# EAGLE design Nixie_Controller (EAGLE 9.0.1)
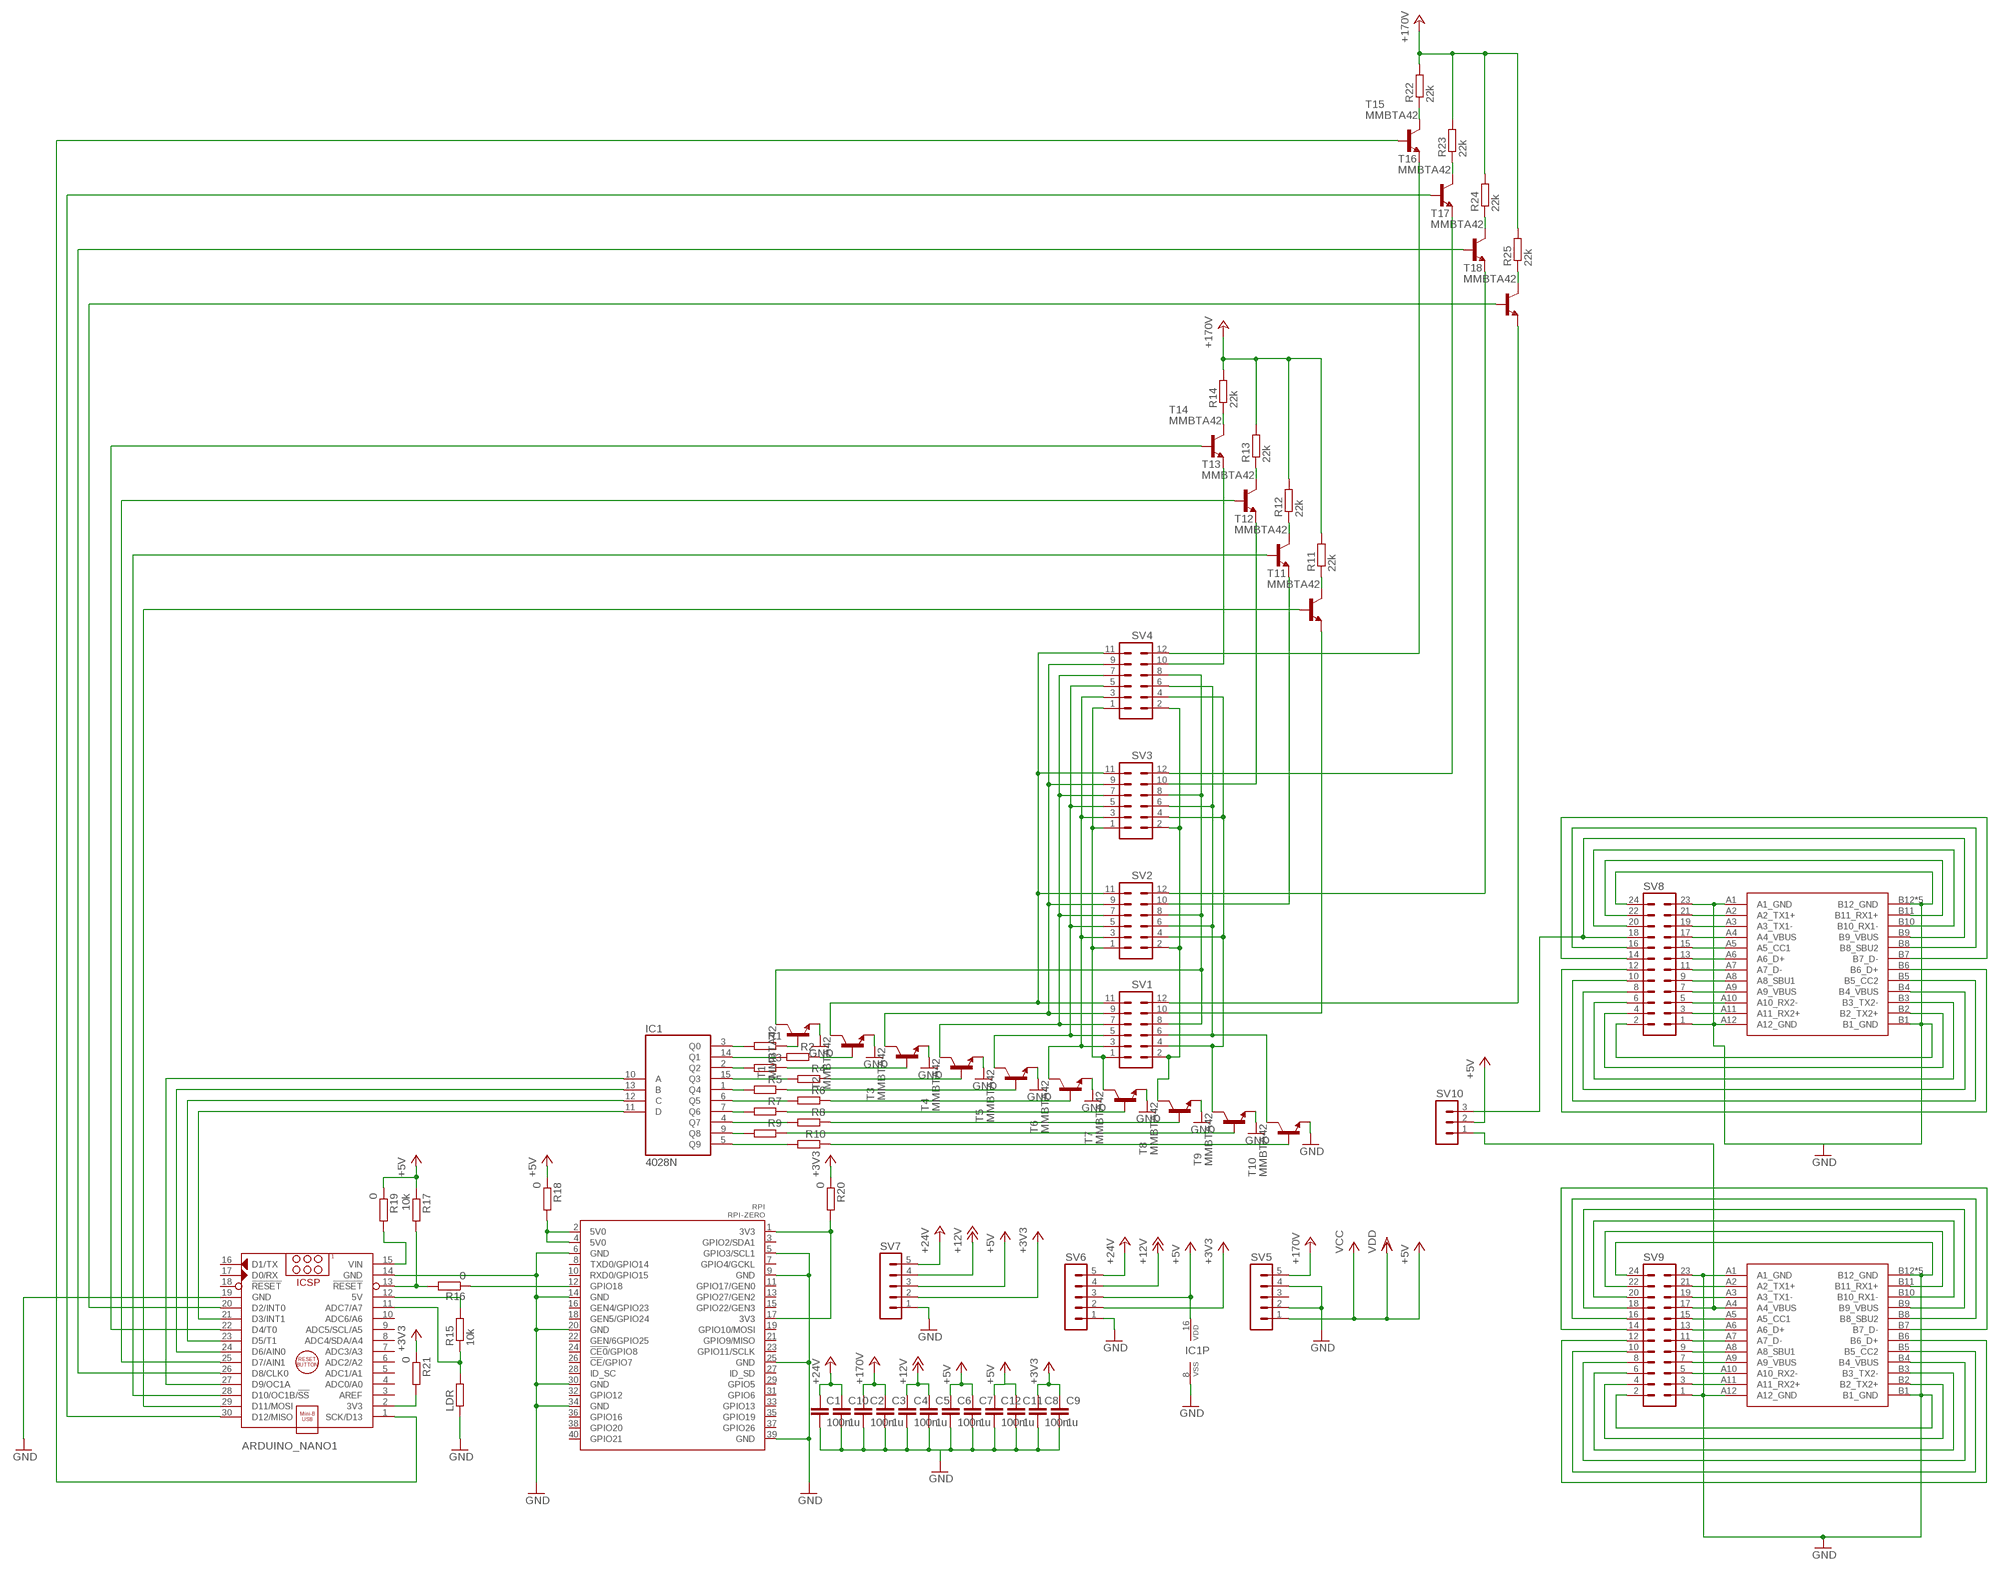
[diagram p0: schematic, sheet 1]

## Parts
ARDUINO_NANO1  ARDUINO_NANO  [ARDUINO_NANO]
C1  100n  C-EUC0805  [C0805]
C2  100n  C-EUC0805  [C0805]
C3  1u  C-EUC0805  [C0805]
C4  100n  C-EUC0805  [C0805]
C5  1u  C-EUC0805  [C0805]
C6  100n  C-EUC0805  [C0805]
C7  1u  C-EUC0805  [C0805]
C8  100n  C-EUC0805  [C0805]
C9  1u  C-EUC0805  [C0805]
C10  1u  C-EUC0805  [C0805]
C11  1u  C-EUC0805  [C0805]
C12  100n  C-EUC0805  [C0805]
IC1  4028N  [DIL16]
LDR  R-EU_0204/7  [0204/7]
R1  R-EU_R0603  [R0603]
R2  R-EU_R0603  [R0603]
R3  R-EU_R0603  [R0603]
R4  R-EU_R0603  [R0603]
R5  R-EU_R0603  [R0603]
R6  R-EU_R0603  [R0603]
R7  R-EU_R0603  [R0603]
R8  R-EU_R0603  [R0603]
R9  R-EU_R0603  [R0603]
R10  R-EU_R0603  [R0603]
R11  22k  R-EU_R0603  [R0603]
R12  22k  R-EU_R0603  [R0603]
R13  22k  R-EU_R0603  [R0603]
R14  22k  R-EU_R0603  [R0603]
R15  10k  R-EU_R0603  [R0603]
R16  0  R-EU_R0603  [R0603]
R17  10k  R-EU_R0603  [R0603]
R18  0  R-EU_R0603  [R0603]
R19  0  R-EU_R0603  [R0603]
R20  0  R-EU_R0603  [R0603]
R21  0  R-EU_R0603  [R0603]
R22  22k  R-EU_R0603  [R0603]
R23  22k  R-EU_R0603  [R0603]
R24  22k  R-EU_R0603  [R0603]
R25  22k  R-EU_R0603  [R0603]
RPI  RPI-ZERO  [RASP_PI_ZERO_BOARD_FULL]
SV1  MA06-2  [MA06-2]
SV2  MA06-2  [MA06-2]
SV3  MA06-2  [MA06-2]
SV4  MA06-2  [MA06-2]
SV5  MA05-1  [MA05-1]
SV6  MA05-1  [MA05-1]
SV7  MA05-1  [MA05-1]
SV8  MA12-2  [MA12-2]
SV9  MA12-2  [MA12-2]
SV10  MA03-1  [MA03-1]
T1  MMBTA42  BC850  [SOT23]
T2  MMBTA42  BC850  [SOT23]
T3  MMBTA42  BC850  [SOT23]
T4  MMBTA42  BC850  [SOT23]
T5  MMBTA42  BC850  [SOT23]
T6  MMBTA42  BC850  [SOT23]
T7  MMBTA42  BC850  [SOT23]
T8  MMBTA42  BC850  [SOT23]
T9  MMBTA42  BC850  [SOT23]
T10  MMBTA42  BC850  [SOT23]
T11  MMBTA42  BC850  [SOT23]
T12  MMBTA42  BC850  [SOT23]
T13  MMBTA42  BC850  [SOT23]
T14  MMBTA42  BC850  [SOT23]
T15  MMBTA42  BC850  [SOT23]
T16  MMBTA42  BC850  [SOT23]
T17  MMBTA42  BC850  [SOT23]
T18  MMBTA42  BC850  [SOT23]
USBC1  USB-TYPE-C  [USB-TYPE-C]
USBC2  USB-TYPE-C  [USB-TYPE-C]

## Nets
3V3@2: R20.2 RPI.1(3V3) RPI.17(3V3)
+3V3: C8.1 C9.1 R20.1 R21.1 SV6.2 SV7.2
+5V: R18.2 RPI.2(5V0) RPI.4(5V0)
+12V: C4.1 C5.1 SV6.4 SV7.4
+24V: C1.1 C10.1 SV6.5 SV7.5
+170V: C2.1 C3.1 R11.2 R12.2 R13.2 R14.2 R22.2 R23.2 R24.2 R25.2 SV5.5
GND: ARDUINO_NANO1.14(GND) ARDUINO_NANO1.19(GND) C1.2 C2.2 C3.2 C4.2 C5.2 C6.2 C7.2 C8.2 C9.2 C10.2 C11.2 C12.2 IC1.8(VSS) LDR.1 RPI.5(GPIO3/SCL1) RPI.6(GND) RPI.9(GND) RPI.14(GND) RPI.20(GND) RPI.25(GND) RPI.30(GND) RPI.34(GND) RPI.39(GND) SV5.2 SV5.4 SV6.1 SV7.1 SV8.1 SV8.2 SV8.23 SV8.24 SV9.1 SV9.2 SV9.23 SV9.24 T1.2(E) T2.2(E) T3.2(E) T4.2(E) T5.2(E) T6.2(E) T7.2(E) T8.2(E) T9.2(E) T10.2(E) USBC1.A1(A1_GND) USBC1.A12(A12_GND) USBC1.B1(B1_GND) USBC1.B12(B12_GND) USBC1.C1(B12_GND) USBC1.C2(B12_GND) USBC1.C3(B12_GND) USBC1.C4(B12_GND) USBC2.A1(A1_GND) USBC2.A12(A12_GND) USBC2.B1(B1_GND) USBC2.B12(B12_GND) USBC2.C1(B12_GND) USBC2.C2(B12_GND) USBC2.C3(B12_GND) USBC2.C4(B12_GND)
N$1: IC1.3(Q0) R1.2
N$2: IC1.14(Q1) R2.2
N$3: IC1.2(Q2) R3.2
N$4: IC1.15(Q3) R4.2
N$5: IC1.1(Q4) R5.2
N$6: IC1.6(Q5) R6.2
N$7: IC1.7(Q6) R7.2
N$8: IC1.4(Q7) R8.2
N$9: IC1.9(Q8) R9.2
N$10: IC1.5(Q9) R10.2
N$11: R1.1 T1.1(B)
N$12: R2.1 T2.1(B)
N$13: R3.1 T3.1(B)
N$14: R4.1 T4.1(B)
N$15: R6.1 T6.1(B)
N$16: R5.1 T5.1(B)
N$17: R7.1 T7.1(B)
N$18: R8.1 T8.1(B)
N$19: R10.1 T10.1(B)
N$20: R9.1 T9.1(B)
N$21: SV1.11 SV2.11 SV3.11 SV4.11 T2.3(C)
N$22: SV1.9 SV2.9 SV3.9 SV4.9 T3.3(C)
N$23: SV1.7 SV2.7 SV3.7 SV4.7 T4.3(C)
N$24: SV1.5 SV2.5 SV3.5 SV4.5 T5.3(C)
N$25: SV1.3 SV2.3 SV3.3 SV4.3 T6.3(C)
N$26: SV1.1 SV2.1 SV3.1 SV4.1 T7.3(C)
N$27: SV1.2 SV2.2 SV3.2 SV4.2 T8.3(C)
N$28: SV1.4 SV2.4 SV3.4 SV4.4 T9.3(C)
N$29: SV1.6 SV2.6 SV3.6 SV4.6 T10.3(C)
N$30: SV1.8 SV2.8 SV3.8 SV4.8 T1.3(C)
N$31: R14.1 T14.3(C)
N$32: R11.1 T11.3(C)
N$33: R12.1 T12.3(C)
N$34: R13.1 T13.3(C)
N$35: SV4.10 T14.2(E)
N$36: SV3.10 T13.2(E)
N$37: SV2.10 T12.2(E)
N$38: SV1.10 T11.2(E)
N$39: ARDUINO_NANO1.2(3V3) R21.2
N$40: ARDUINO_NANO1.28(D10/OC1B/!SS) T12.1(B)
N$41: SV8.21 USBC2.A2(A2_TX1+)
N$42: SV8.19 USBC2.A3(A3_TX1-)
N$43: ARDUINO_NANO1.13(!RESET) R16.2 R17.2
N$44: ARDUINO_NANO1.12(5V) R15.2
N$45: ARDUINO_NANO1.11(ADC7/A7) LDR.2 R15.1
N$46: ARDUINO_NANO1.29(D11/MOSI) T11.1(B)
N$47: SV8.17 USBC2.A4(A4_VBUS)
N$48: ARDUINO_NANO1.25(D7/AIN1) T13.1(B)
N$49: ARDUINO_NANO1.22(D4/T0) T14.1(B)
N$50: SV8.15 USBC2.A5(A5_CC1)
N$51: SV8.13 USBC2.A6(A6_D+)
N$52: SV8.11 USBC2.A7(A7_D-)
N$53: SV8.9 USBC2.A8(A8_SBU1)
N$54: SV8.7 USBC2.A9(A9_VBUS)
N$55: SV8.5 USBC2.A10(A10_RX2-)
N$56: SV8.3 USBC2.A11(A11_RX2+)
N$57: R22.1 T15.3(C)
N$58: R25.1 T18.3(C)
N$59: SV9.21 USBC1.A2(A2_TX1+)
N$60: SV9.19 USBC1.A3(A3_TX1-)
N$61: SV9.17 SV10.1 USBC1.A4(A4_VBUS)
N$62: SV9.15 USBC1.A5(A5_CC1)
N$63: SV9.13 USBC1.A6(A6_D+)
N$64: SV9.11 USBC1.A7(A7_D-)
N$65: SV9.9 USBC1.A8(A8_SBU1)
N$66: SV9.7 USBC1.A9(A9_VBUS)
N$67: SV9.5 USBC1.A10(A10_RX2-)
N$68: SV9.3 USBC1.A11(A11_RX2+)
N$69: R24.1 T17.3(C)
N$70: R23.1 T16.3(C)
N$71: SV9.4 USBC1.B2(B2_TX2+)
N$72: SV9.6 USBC1.B3(B3_TX2-)
N$73: SV9.8 USBC1.B4(B4_VBUS)
N$74: SV9.10 USBC1.B5(B5_CC2)
N$75: SV9.12 USBC1.B6(B6_D+)
N$76: SV4.12 T15.2(E)
N$77: SV9.22 USBC1.B11(B11_RX1+)
N$78: SV9.20 USBC1.B10(B10_RX1-)
N$79: SV9.18 USBC1.B9(B9_VBUS)
N$80: SV9.16 USBC1.B8(B8_SBU2)
N$81: SV9.14 USBC1.B7(B7_D-)
N$82: SV3.12 T16.2(E)
N$83: SV8.4 USBC2.B2(B2_TX2+)
N$84: SV8.6 USBC2.B3(B3_TX2-)
N$85: SV8.8 USBC2.B4(B4_VBUS)
N$86: SV8.10 USBC2.B5(B5_CC2)
N$87: SV8.12 USBC2.B6(B6_D+)
N$88: SV2.12 T17.2(E)
N$89: SV8.22 USBC2.B11(B11_RX1+)
N$90: SV8.20 USBC2.B10(B10_RX1-)
N$91: SV8.18 SV10.3 USBC2.B9(B9_VBUS)
N$92: SV8.16 USBC2.B8(B8_SBU2)
N$93: SV8.14 USBC2.B7(B7_D-)
N$94: R16.1 RPI.12(GPIO18)
N$95: SV1.12 T18.2(E)
N$96: ARDUINO_NANO1.15(VIN) R19.2
N$101: ARDUINO_NANO1.1(SCK/D13) T15.1(B)
N$102: ARDUINO_NANO1.20(D2/INT0) T18.1(B)
N$103: ARDUINO_NANO1.26(D8/CLK0) T17.1(B)
N$104: ARDUINO_NANO1.30(D12/MISO) T16.1(B)
N$122: ARDUINO_NANO1.21(D3/INT1) IC1.11(D)
N$123: ARDUINO_NANO1.23(D5/T1) IC1.12(C)
N$124: ARDUINO_NANO1.24(D6/AIN0) IC1.13(B)
N$125: ARDUINO_NANO1.27(D9/OC1A) IC1.10(A)
VDD: C6.1 C7.1 C11.1 C12.1 IC1.16(VDD) R17.1 R18.1 R19.1 SV5.1 SV6.3 SV7.3 SV10.2 ; supply symbol labelled VCC, +5V
Unconnected: ARDUINO_NANO1.3(AREF) ARDUINO_NANO1.4(ADC0/A0) ARDUINO_NANO1.5(ADC1/A1) ARDUINO_NANO1.6(ADC2/A2) ARDUINO_NANO1.7(ADC3/A3) ARDUINO_NANO1.8(ADC4/SDA/A4) ARDUINO_NANO1.9(ADC5/SCL/A5) ARDUINO_NANO1.10(ADC6/A6) ARDUINO_NANO1.16(D1/TX) ARDUINO_NANO1.17(D0/RX) ARDUINO_NANO1.18(!RESET) RPI.3(GPIO2/SDA1) RPI.7(GPIO4/GCKL) RPI.8(TXD0/GPIO14) RPI.10(RXD0/GPIO15) RPI.11(GPIO17/GEN0) RPI.13(GPIO27/GEN2) RPI.15(GPIO22/GEN3) RPI.16(GEN4/GPIO23) RPI.18(GEN5/GPIO24) RPI.19(GPIO10/MOSI) RPI.21(GPIO9/MISO) RPI.22(GEN/6GPIO25) RPI.23(GPIO11/SCLK) RPI.24(!CE0!/GPIO8) RPI.26(!CE!/GPIO7) RPI.27(ID_SD) RPI.28(ID_SC) RPI.29(GPIO5) RPI.31(GPIO6) RPI.32(GPIO12) RPI.33(GPIO13) RPI.35(GPIO19) RPI.36(GPIO16) RPI.37(GPIO26) RPI.38(GPIO20) RPI.40(GPIO21) SV5.3

## Library data of the parts
ARDUINO_NANO1 = ArduinoNanoV30:ARDUINO_NANO: Arduino Nano V3.0 Module Overview: The Arduino Nano is a small, complete, and breadboard-friendly board based on the ATmega328 (Arduino Nano 3.x) or ATmega168 (Arduino Nano 2.x). It has more or less the same functionality of the Arduino Duemilanove, but in a different package. It lacks only a DC power jack, and works with a Mini-B USB cable instead of a standard one. The Nano was designed and is being produced by Gravitech <http://www.gravitech.us/arna30wiatp.html>. General specifications: Item Value Microcontroller Atmel ATmega168 or ATmega328 Operating Voltage (logic level) 5 V Input Voltage (recommended) 7-12 V Input Voltage (limits) 6-20 V Digital I/O Pins 14 (of which 6 provide PWM output) Analog Input Pins 8 DC Current per I/O Pin 40 mA Flash Memory 16 KB (ATmega168) or 32 KB (ATmega328) of which 2 KB used by bootloader SRAM 1 KB (ATmega168) or 2 KB (ATmega328) EEPROM 512 bytes (ATmega168) or 1 KB (ATmega328) Clock Speed 16 MHz Dimensions (Inches) 0.73" x 1.70" Dimensions (mm) 18mm x 45mm Overall height About 9 mm (not including pins) Weigth 5 g Power: The Arduino Nano can be powered via the Mini-B USB connection, 6-20V unregulated external power supply (pin 30), or 5V regulated external power supply (pin 27). The power source is automatically selected to the highest voltage source. Memory: The ATmega168 has 16 KB of flash memory for storing code (of which 2 KB is used for the bootloader); the ATmega328 has 32 KB, (also with 2 KB used for the bootloader). The ATmega168 has 1 KB of SRAM and 512 bytes of EEPROM (which can be read and written with the EEPROM library); the ATmega328 has 2 KB of SRAM and 1 KB of EEPROM. Input and Output: Each of the 14 digital pins on the Nano can be used as an input or output, using pinMode(), digitalWrite(), and digitalRead() functions. They operate at 5 volts. Each pin can provide or receive a maximum of 40 mA and has an internal pull-up resistor (disconnected by default) of 20-50 kOhms. In addition, some pins have specialized functions. Visit Arduino - ArduinoBoardNano <https://www.arduino.cc/en/Main/ArduinoBoardNano>
C1-C12 = resistor:C-EU: CAPACITOR, European symbol
IC1 = 40xx:4028: BCD to decimal DECODER
LDR R1-R25 = resistor:R-EU_: RESISTOR, European symbol
RPI = rpi-zero:RPI-ZERO
SV1-SV4 = con-lstb:MA06-2: PIN HEADER; OC_FARNELL: unknown; OC_NEWARK: unknown
SV5-SV7 = con-lstb:MA05-1: PIN HEADER; OC_FARNELL: unknown; OC_NEWARK: unknown
SV8 SV9 = con-lstb:MA12-2: PIN HEADER; OC_FARNELL: unknown; OC_NEWARK: unknown
SV10 = con-lstb:MA03-1: PIN HEADER; OC_FARNELL: unknown; OC_NEWARK: unknown
T1-T18 = transistor:BC850: NPN TRANSISTOR
USBC1 USBC2 = Nixie_library:USB-TYPE-C

## Board
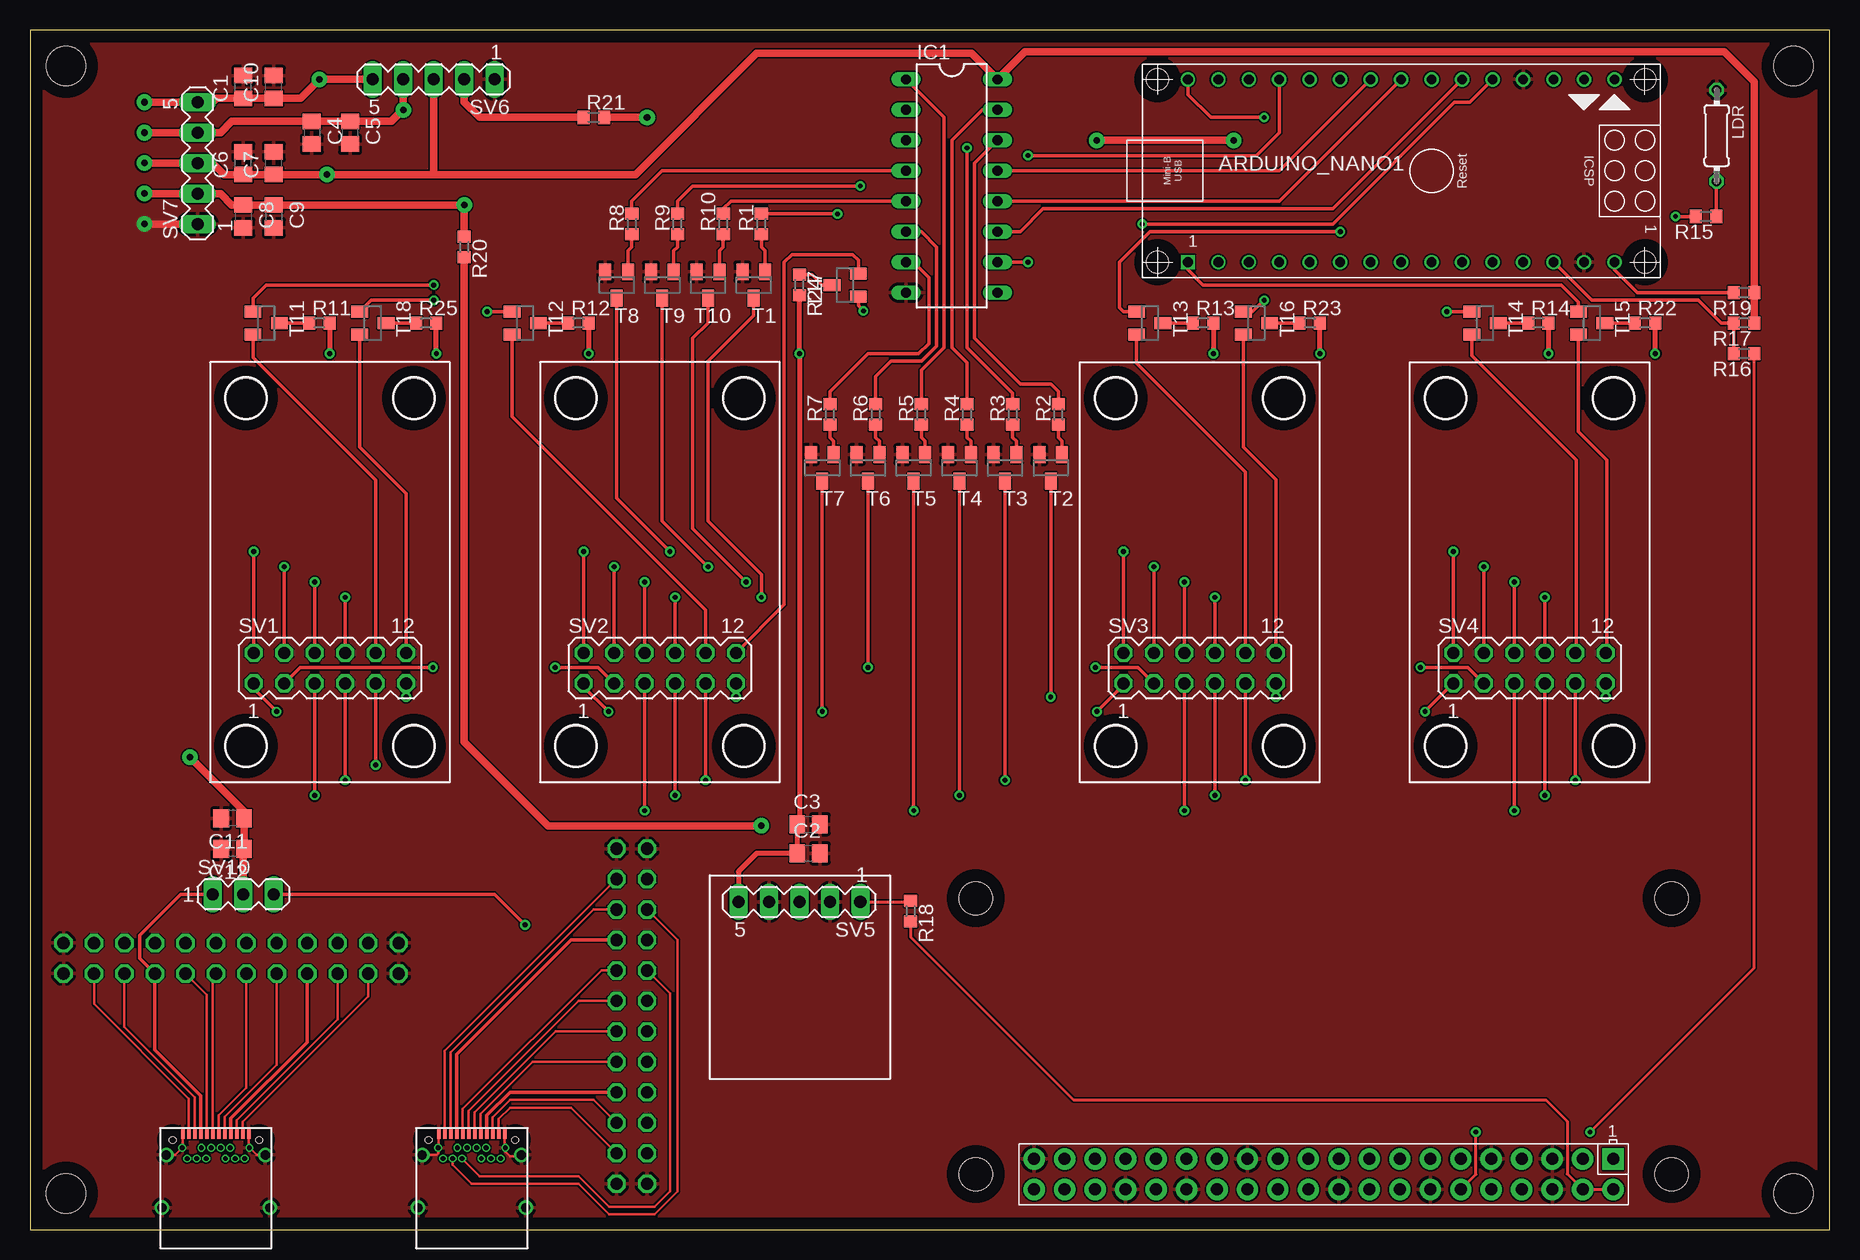
[diagram p1: board, top side]
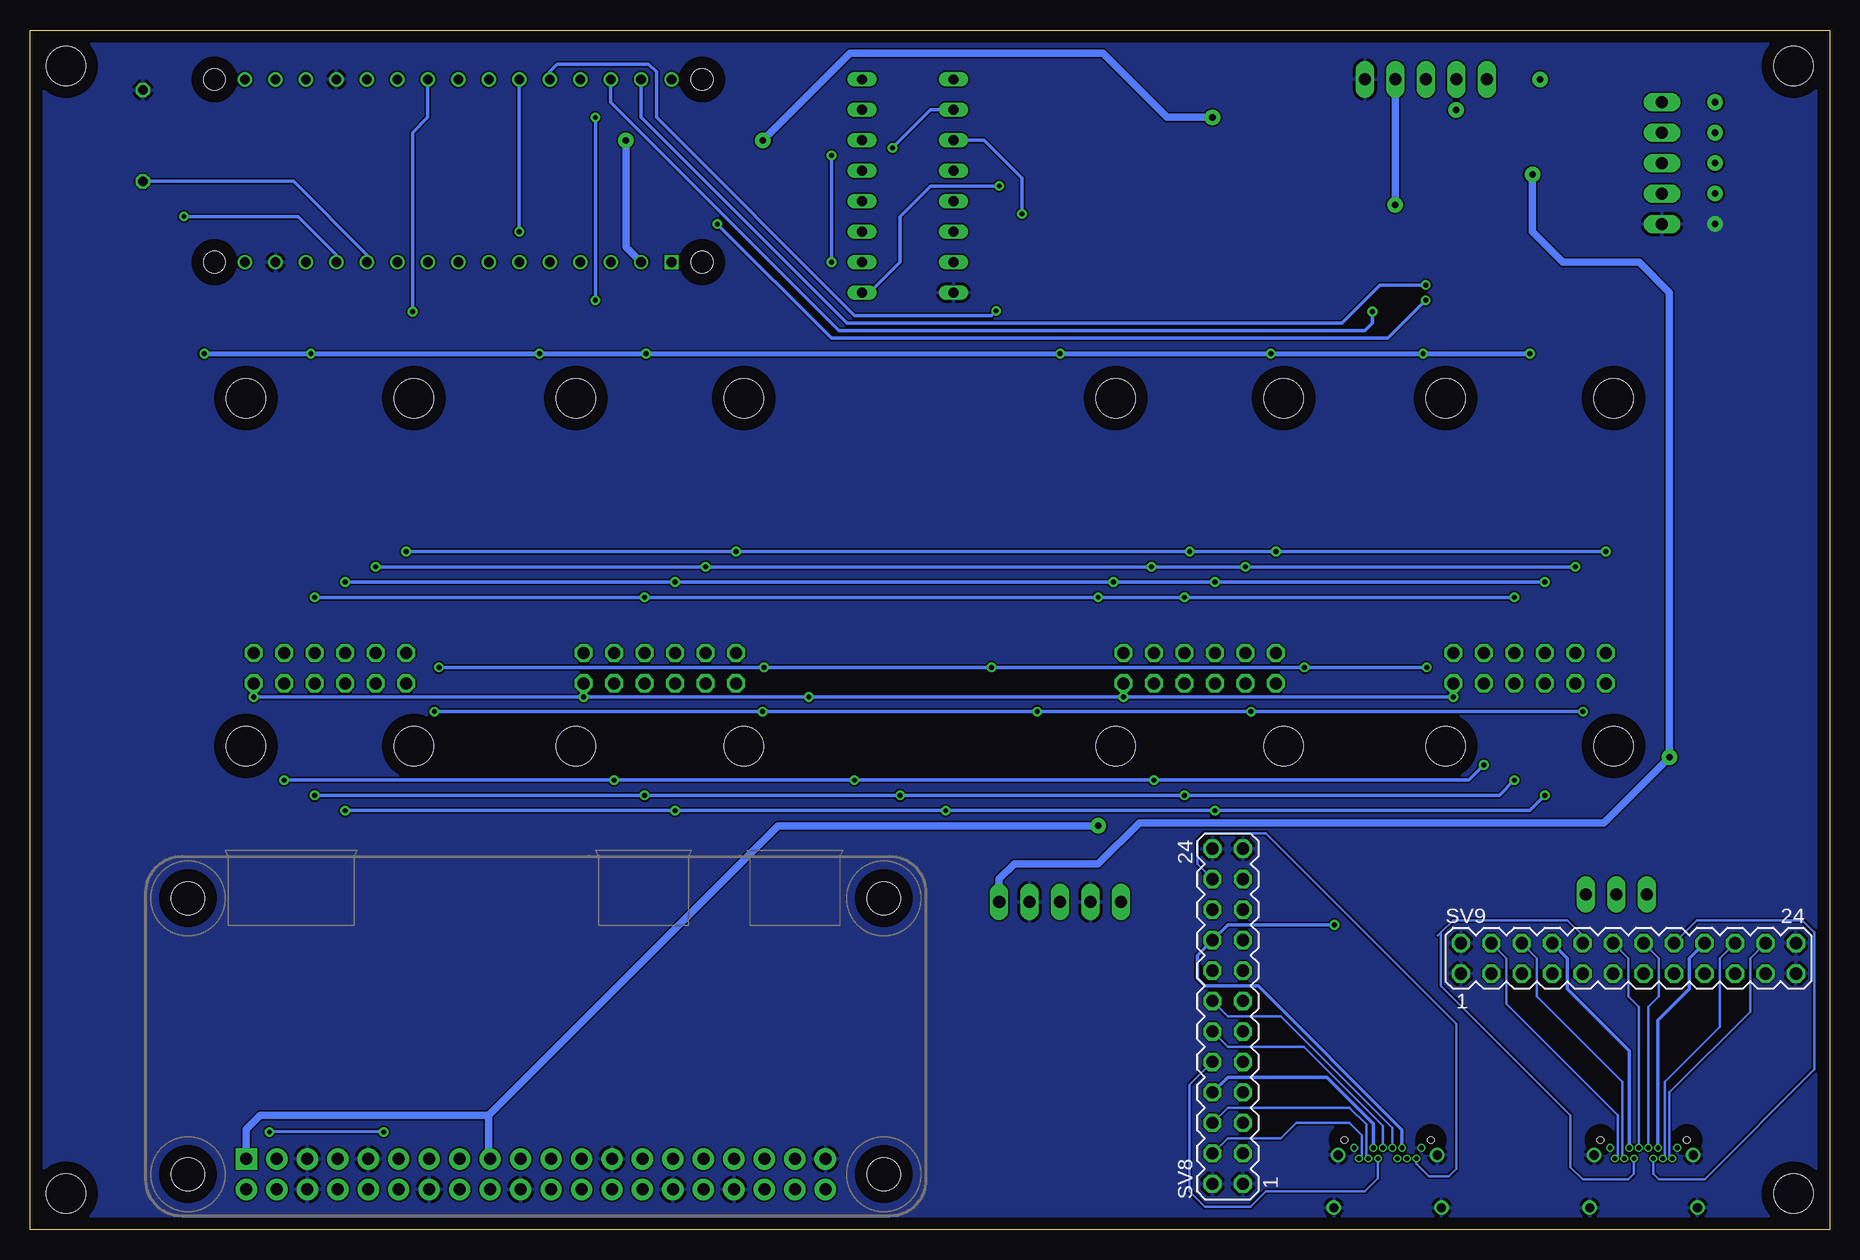
[diagram p2: board, bottom side, seen from below]

Size 150 x 100 mm. Coordinates in mm from the lower left corner, seen from the top.
Outline: 0,0 150,0 150,100 0,100 0,0
Copper layers (1*16): Top 0.035mm / dielectric 1.5mm / Bottom 0.035mm
Design rules "default *": minimum track width 0.2mm, minimum drill 0.35mm, track to track 5mil, track to pad 5mil, pad to pad 5mil, via to via 5mil, smd to smd 5mil, copper to edge 40mil, drill to drill 1mil, minimum pad ring 1mil, minimum via ring 8mil, stop-mask expansion 4mil, vias tented up to drill 0mil, thermal gap 10mil
Holes 3.3 mm at 18,69.3 32,69.3 18,40.3 32,40.3 45.5,40.3 59.5,40.3 90.5,40.3 118,40.3 104.5,40.3 132,40.3 132,69.3 118,69.3 104.5,69.3 90.5,69.3 59.5,69.3 45.5,69.3 3,97 3,3 147,3 147,97
tKeepout: area 16.2,38.5 to 19.8,42; area 30.2,38.5 to 33.7,42; area 30.2,67.5 to 33.7,71; area 16.2,67.5 to 19.8,71; area 88.8,38.5 to 92.3,42; area 102.7,38.5 to 106.2,42; area 88.8,67.5 to 92.3,71; area 102.7,67.5 to 106.2,71; area 116.2,67.5 to 119.8,71; area 130.2,67.5 to 133.8,71; area 116.2,38.5 to 119.8,42; area 130.2,38.5 to 133.8,42
bKeepout: area 57.8,38.5 to 61.2,42; area 43.8,38.5 to 47.2,42; area 57.8,67.5 to 61.2,71; area 43.8,67.5 to 47.2,71; area 88.8,67.5 to 92.2,71; area 102.8,67.5 to 106.2,71; area 116.2,67.5 to 119.8,71; area 130.2,67.5 to 133.8,71; area 130.2,38.5 to 133.8,42; area 116.2,38.5 to 119.8,42; area 30.2,38.5 to 33.8,42; area 16.2,38.5 to 19.8,42; 2 more areas

### Footprints (pad centres in the part's own frame; a part is rotated, then mirrored left to right if it is on the bottom)
ARDUINO_NANO = drill 0.8 square: 1 -20.32,-7.62 | drill 0.8: 2 -17.78,-7.62; 3 -15.24,-7.62; 4 -12.7,-7.62; 5 -10.16,-7.62; 6 -7.62,-7.62; 7 -5.08,-7.62; 8 -2.54,-7.62; 9 0,-7.62; 10 2.54,-7.62; 11 5.08,-7.62; 12 7.62,-7.62; 13 10.16,-7.62; 14 12.7,-7.62; 15 15.24,-7.62; 16 15.24,7.62; 17 12.7,7.62; 18 10.16,7.62; 19 7.62,7.62; 20 5.08,7.62; 21 2.54,7.62; 22 0,7.62; 23 -2.54,7.62; 24 -5.08,7.62; 25 -7.62,7.62; 26 -10.16,7.62; 27 -12.7,7.62; 28 -15.24,7.62; 29 -17.78,7.62; 30 -20.32,7.62 | hole 1.778: -22.86,-7.62; -22.86,7.62; 17.78,7.62; 17.78,-7.62
C0805 = smd 1.3 x 1.5: 1 -0.95,0; 2 0.95,0
DIL16 = drill 0.813 long: 1 -8.89,-3.81; 2 -6.35,-3.81; 3 -3.81,-3.81; 4 -1.27,-3.81; 5 1.27,-3.81; 6 3.81,-3.81; 7 6.35,-3.81; 8 8.89,-3.81; 9 8.89,3.81; 10 6.35,3.81; 11 3.81,3.81; 12 1.27,3.81; 13 -1.27,3.81; 14 -3.81,3.81; 15 -6.35,3.81; 16 -8.89,3.81
0204/7 = drill 0.813 octagon: 1 -3.81,0; 2 3.81,0
R0603 = smd 1 x 1.1: 1 -0.85,0; 2 0.85,0
RASP_PI_ZERO_BOARD_FULL = drill 1 pad 1.778 square: 1 8.37,25.23 | drill 1 pad 1.778: 2 8.37,27.77; 3 10.91,25.23; 4 10.91,27.77; 5 13.45,25.23; 6 13.45,27.77; 7 15.99,25.23; 8 15.99,27.77; 9 18.53,25.23; 10 18.53,27.77; 11 21.07,25.23; 12 21.07,27.77; 13 23.61,25.23; 14 23.61,27.77; 15 26.15,25.23; 16 26.15,27.77; 17 28.69,25.23; 18 28.69,27.77; 19 31.23,25.23; 20 31.23,27.77; 21 33.77,25.23; 22 33.77,27.77; 23 36.31,25.23; 24 36.31,27.77; 25 38.85,25.23; 26 38.85,27.77; 27 41.39,25.23; 28 41.39,27.77; 29 43.93,25.23; 30 43.93,27.77; 31 46.47,25.23; 32 46.47,27.77; 33 49.01,25.23; 34 49.01,27.77; 35 51.55,25.23; 36 51.55,27.77; 37 54.09,25.23; 38 54.09,27.77; 39 56.63,25.23; 40 56.63,27.77 | hole 2.75: 3.5,3.5; 3.5,26.5; 61.5,3.5; 61.5,26.5
MA06-2 = drill 1.016 octagon: 1 -6.35,-1.27; 2 -6.35,1.27; 3 -3.81,-1.27; 4 -3.81,1.27; 5 -1.27,-1.27; 6 -1.27,1.27; 7 1.27,-1.27; 8 1.27,1.27; 9 3.81,-1.27; 10 3.81,1.27; 11 6.35,-1.27; 12 6.35,1.27
MA05-1 = drill 1.016 long: 1 -5.08,0; 2 -2.54,0; 3 0,0; 4 2.54,0; 5 5.08,0
MA12-2 = drill 1.016 octagon: 1 -13.97,-1.27; 2 -13.97,1.27; 3 -11.43,-1.27; 4 -11.43,1.27; 5 -8.89,-1.27; 6 -8.89,1.27; 7 -6.35,-1.27; 8 -6.35,1.27; 9 -3.81,-1.27; 10 -3.81,1.27; 11 -1.27,-1.27; 12 -1.27,1.27; 13 1.27,-1.27; 14 1.27,1.27; 15 3.81,-1.27; 16 3.81,1.27; 17 6.35,-1.27; 18 6.35,1.27; 19 8.89,-1.27; 20 8.89,1.27; 21 11.43,-1.27; 22 11.43,1.27; 23 13.97,-1.27; 24 13.97,1.27
MA03-1 = drill 1.016 long: 1 -2.54,0; 2 0,0; 3 2.54,0
SOT23 = smd 1 x 1.4: 1 -0.95,-1.1; 2 0.95,-1.1; 3 0,1.1
USB-TYPE-C = smd 0.3 x 0.9: A1 -2.75,2.57; A2 -2.25,2.57; A3 -1.75,2.57; A4 -1.25,2.57; A5 -0.75,2.57; A6 -0.25,2.57; A7 0.25,2.57; A8 0.75,2.57; A9 1.25,2.57; A10 1.75,2.57; A11 2.25,2.57; A12 2.75,2.57 | drill 0.4 pad 0.65: B1 2.8,1.35; B2 2.4,0.45; B3 1.6,0.45; B4 1.2,1.35; B5 0.8,0.45; B6 0.4,1.35; B7 -0.4,1.35; B8 -0.8,0.45; B9 -1.2,1.35; B10 -1.6,0.45; B11 -2.4,0.45; B12 -2.8,1.35 | drill 0.76 pad 1.2: C1 4.13,0.75; C2 4.49,-3.64; C3 -4.49,-3.64; C4 -4.13,0.75 | hole 0.55: -3.6,2; 3.6,2

### Placement (x,y rotation side)
ARDUINO_NANO1  116.84,88.27 0 top
C1  17.78,95.25 90 top
C2  64.9,31.37 0 top
C3  64.9,33.78 0 top
C4  23.5,91.44 270 top
C5  26.67,91.44 270 top
C6  17.78,88.9 90 top
C7  20.32,88.9 90 top
C8  17.78,84.45 270 top
C9  20.32,84.45 270 top
C10  20.32,95.25 90 top
C11  16.89,34.29 180 top
C12  16.89,31.75 180 top
IC1  76.83,87 270 top
LDR  140.59,91.19 270 top
R1  60.96,83.82 90 top
R2  85.72,67.94 90 top
R3  81.92,67.94 90 top
R4  78.11,67.94 90 top
R5  74.3,67.94 90 top
R6  70.48,67.94 90 top
R7  66.67,67.94 90 top
R8  50.16,83.82 90 top
R9  53.98,83.82 90 top
R10  57.78,83.82 90 top
R11  24.13,75.56 0 top
R12  45.72,75.56 0 top
R13  97.79,75.56 0 top
R14  125.73,75.56 0 top
R15  139.7,84.45 180 top
R16  142.88,73.03 180 top
R17  142.88,75.56 180 top
R18  73.41,26.54 270 top
R19  142.88,78.11 180 top
R20  36.2,81.92 270 top
R21  46.99,92.71 0 top
R22  134.62,75.56 0 top
R23  106.68,75.56 0 top
R24  64.14,78.74 270 top
R25  33.02,75.56 0 top
RPI  140.34,31.11 180 top
SV1  25,46.8 0 top
SV2  52.5,46.8 0 top
SV3  97.5,46.8 0 top
SV4  125,46.8 0 top
SV5  64.14,27.3 180 top
SV6  33.66,95.89 180 top
SV7  13.97,88.9 90 top
SV8  50.16,17.78 90 bottom
SV9  16.76,22.61 0 bottom
SV10  17.78,27.94 0 top
T1  60.33,78.74 180 top
T2  85.09,63.5 180 top
T3  81.28,63.5 180 top
T4  77.47,63.5 180 top
T5  73.66,63.5 180 top
T6  69.85,63.5 180 top
T7  66.04,63.5 180 top
T8  48.9,78.74 180 top
T9  52.7,78.74 180 top
T10  56.52,78.74 180 top
T11  19.68,75.56 270 top
T12  41.27,75.56 270 top
T13  93.34,75.56 270 top
T14  121.28,75.56 270 top
T15  130.18,75.56 270 top
T16  102.23,75.56 270 top
T17  67.94,78.74 90 top
T18  28.57,75.56 270 top
USBC1  15.49,5.46 0 top
USBC2  36.83,5.46 0 top

### Tracks (layer width: path | path; a pad name or v marks a point on that pad's centre or on a via)
3V3@2  (via drill 0.55 pad 1.3)
  Top 0.61: R20.2 36.2,40.64 43.18,33.66 v60.96,33.66
  Bottom 0.61: RPI.1 131.97,8.37 130.81,9.53 111.76,9.53 | RPI.17 111.76,6 111.76,9.53 | v60.96,33.66 87.63,33.66 111.76,9.53
+3V3  (via drill 0.55 pad 1.3)
  Top 0.61: SV6.2 36.2,93.98 37.47,92.71 R21.1 | v9.53,86.36 SV7.2 15.88,86.36 16.83,85.41 C8.1 C9.1 v36.2,85.41 R20.1
  Bottom 0.61: SV6.2 v36.2,85.41
+5V
  Top 0.254: RPI.2 RPI.4 128.14,4.63 128.14,9.02 126.36,10.79 87,10.79 73.41,24.38 R18.2
+12V  (via drill 0.55 pad 1.3)
  Top 0.305: 29.84,92.39 30.8,93.34 v31.11,93.34
  Top 0.61: SV6.4 v31.11,93.34 30.16,92.39 29.84,92.39 C5.1 C4.1 16.82,92.39 15.88,91.44 SV7.4 v9.53,91.44
+24V  (via drill 0.55 pad 1.3)
  Top 0.61: SV6.5 v24.13,95.89 22.55,94.3 C10.1 C1.1 15.56,94.3 15.24,93.98 SV7.5 v9.53,93.98
+170V  (via drill 0.4 pad 0.65)
  Top 0.406: SV5.5 59.05,29.84 60.58,31.37 C2.1 C3.1 64.14,33.97 v64.14,73.03 R24.2 | R11.2 v24.98,73.03 | v135.47,73.03 R22.2 | R13.2 v98.64,73.03 | R14.2 v126.58,73.03 | v107.53,73.03 R23.2 | R12.2 v46.57,73.03 | v33.87,73.03 R25.2
  Bottom 0.406: v24.98,73.03 v33.87,73.03 v46.57,73.03 v64.14,73.03 v98.64,73.03 v107.53,73.03 v126.58,73.03 v135.47,73.03
GND  (via drill 0.55 pad 1.3)
  Top 0.203: USBC2.C1 40.84,6.1 40.01,6.1 39.63,6.47 USBC2.B1 39.58,6.86 USBC2.A12 | USBC2.C4 33.9,6.21 34.03,6.34 USBC2.B12 34.08,6.86 USBC2.A1 | USBC1.C1 18.89,6.21 USBC1.B1 18.24,6.86 USBC1.A12 | USBC1.C4 12.09,6.21 USBC1.B12 12.74,6.86 USBC1.A1
  Top 0.61: SV7.1 v9.53,83.82
  pour Top: 0,100 150,100 150,0 0,0
  pour Bottom: 0,100 0,0 150,0 150,100
N$1  (via drill 0.4 pad 0.65)
  Top 0.305: R1.2 v67.31,84.67
  Bottom 0.305: IC1.3 70.48,90.81 67.31,87.63 v67.31,84.67
N$2
  Top 0.305: IC1.14 78.74,88.9 78.74,74.3 82.55,70.48 85.09,70.48 85.72,69.85 R2.2
N$3  (via drill 0.4 pad 0.65)
  Top 0.305: R3.2 81.92,69.72 78.11,73.53 v78.11,90.17
  Bottom 0.305: v78.11,90.17 74.93,93.34 IC1.2
N$4
  Top 0.305: IC1.15 79.38,93.34 76.83,90.81 76.83,73.53 78.11,72.26 R4.2
N$5
  Top 0.305: IC1.1 76.2,92.71 76.2,73.53 74.3,71.63 R5.2
N$6
  Top 0.305: IC1.6 74.3,83.19 75.56,81.92 75.56,73.66 74.3,72.39 71.75,72.39 70.48,71.12 R6.2
N$7
  Top 0.305: IC1.7 73.66,80.64 74.93,79.38 74.93,73.88 74.08,73.03 69.85,73.03 66.67,69.85 R7.2
N$8
  Top 0.305: R8.2 50.16,85.72 52.7,88.27 IC1.4
N$9  (via drill 0.4 pad 0.65)
  Top 0.305: R9.2 53.98,85.72 55.24,87 v69.22,87
  Bottom 0.305: v69.22,87 74.93,87 77.47,84.45 77.47,80.64 80.01,78.11 IC1.9
N$10
  Top 0.305: R10.2 57.78,85.09 58.42,85.72 IC1.5
N$11
  Top 0.305: R1.1 60.96,81.92 61.27,81.6 T1.1
N$12
  Top 0.305: R2.1 85.72,66.04 86.04,65.72 T2.1
N$13
  Top 0.305: R3.1 81.92,66.04 82.23,65.72 T3.1
N$14
  Top 0.305: R4.1 78.11,66.04 78.42,65.72 T4.1
N$15
  Top 0.305: R6.1 70.48,66.04 70.8,65.72 T6.1
N$16
  Top 0.305: R5.1 74.3,66.04 74.61,65.72 T5.1
N$17
  Top 0.305: R7.1 66.67,66.04 66.99,65.72 T7.1
N$18
  Top 0.305: R8.1 50.16,81.92 49.84,81.59 T8.1
N$19
  Top 0.305: R10.1 57.78,81.92 57.47,81.59 T10.1
N$20
  Top 0.305: R9.1 53.98,81.92 53.66,81.59 T9.1
N$21  (via drill 0.4 pad 0.65)
  Top 0.305: SV1.11 v31.35,44.4 | SV4.11 v131.35,44.4 | SV3.11 v103.85,44.4 | SV2.11 v58.85,44.4 | T2.3 v85.09,44.4
  Bottom 0.305: v31.35,44.4 v58.85,44.4 v85.09,44.4 v103.85,44.4 v131.35,44.4
N$22  (via drill 0.4 pad 0.65)
  Top 0.305: SV1.9 v28.81,38.73 | v128.81,37.47 SV4.9 | SV3.9 v101.31,37.47 | SV2.9 v56.31,37.47 | T3.3 v81.28,37.47
  Bottom 0.305: v28.81,38.73 30.08,37.47 v56.31,37.47 v81.28,37.47 v101.31,37.47 v128.81,37.47
N$23  (via drill 0.4 pad 0.65)
  Top 0.305: SV1.7 v26.27,37.47 | v126.27,36.2 SV4.7 | SV3.7 v98.77,36.2 | SV2.7 v53.77,36.2 | T4.3 v77.47,36.2
  Bottom 0.305: v26.27,37.47 27.54,36.2 v53.77,36.2 v77.47,36.2 v98.77,36.2 v126.27,36.2
N$24  (via drill 0.4 pad 0.65)
  Top 0.305: SV1.5 v23.73,36.2 | v123.73,34.92 SV4.5 | SV3.5 v96.23,34.92 | SV2.5 v51.23,34.92 | T5.3 v73.66,34.92
  Bottom 0.305: v23.73,36.2 25,34.92 v51.23,34.92 v73.66,34.92 v96.23,34.92 v123.73,34.92
N$25  (via drill 0.4 pad 0.65)
  Top 0.305: T6.3 v69.85,46.86 | v43.77,46.86 47.36,46.86 SV2.3 | v115.9,46.86 119.86,46.86 SV4.3 | SV3.3 92.36,46.86 v88.81,46.86 | SV1.3 22.52,46.86 v33.58,46.86
  Bottom 0.305: v33.58,46.86 v43.77,46.86 v69.85,46.86 v88.81,46.86 v115.9,46.86
N$26  (via drill 0.4 pad 0.65)
  Top 0.305: SV4.1 118.65,45.55 v116.28,43.18 | T7.3 v66.04,43.18 | SV1.1 18.65,45.09 v20.55,43.18 | SV2.1 46.15,45.25 v48.22,43.18 | v88.94,43.18 91.15,45.39 SV3.1
  Bottom 0.305: v20.55,43.18 v48.22,43.18 v66.04,43.18 v88.94,43.18 v116.28,43.18
N$27  (via drill 0.4 pad 0.65)
  Top 0.305: SV2.2 v46.15,56.52 | v18.65,56.52 SV1.2 | SV3.2 v91.15,56.52 | SV4.2 v118.65,56.52 | T8.3 48.9,60.96 v53.34,56.52
  Bottom 0.305: v18.65,56.52 v46.15,56.52 v53.34,56.52 v91.15,56.52 v118.65,56.52
N$28  (via drill 0.4 pad 0.65)
  Top 0.305: 52.7,77.47 T9.3 52.7,59.05 v56.52,55.24 | SV2.4 v48.69,55.24 | v21.19,55.24 SV1.4 | SV3.4 v93.69,55.24 | SV4.4 v121.19,55.24
  Bottom 0.305: v21.19,55.24 v48.69,55.24 v56.52,55.24 v93.69,55.24 v121.19,55.24
N$29  (via drill 0.4 pad 0.65)
  Top 0.305: SV2.6 v51.23,53.98 | v23.73,53.98 SV1.6 | SV3.6 v96.23,53.98 | SV4.6 v123.73,53.98 | T10.3 56.52,75.56 55.24,74.3 55.24,58.42 v59.69,53.98
  Bottom 0.305: v23.73,53.98 v51.23,53.98 v59.69,53.98 v96.23,53.98 v123.73,53.98
N$30  (via drill 0.4 pad 0.65)
  Top 0.305: SV2.8 v53.77,52.7 | v26.27,52.7 SV1.8 | SV3.8 v98.77,52.7 | SV4.8 v126.27,52.7 | T1.3 60.33,76.2 56.52,72.39 56.52,59.05 60.96,54.61 v60.96,52.7
  Bottom 0.305: v26.27,52.7 v53.77,52.7 v60.96,52.7 v98.77,52.7 v126.27,52.7
N$31
  Top 0.305: R14.1 T14.3
N$32
  Top 0.305: R11.1 T11.3
N$33
  Top 0.305: R12.1 T12.3
N$34
  Top 0.305: T13.3 R13.1
N$35
  Top 0.305: T14.2 120.19,72.86 128.91,64.14 128.91,48.16 SV4.10
N$36
  Top 0.305: T13.2 92.25,72.22 101.31,63.16 SV3.10
N$37
  Top 0.305: SV2.10 56.31,51.64 40.17,67.78 T12.2
N$38
  Top 0.305: T11.2 18.59,72.7 28.81,62.48 SV1.10
N$39  (via drill 0.55 pad 1.3)
  Top 0.61: R21.2 v51.44,92.71 | v88.9,90.81 v100.33,90.81
  Bottom 0.61: v51.44,92.71 55.24,92.71 60.58,98.04 81.66,98.04 v88.9,90.81 | ARDUINO_NANO1.2 100.33,81.92 v100.33,90.81
N$40  (via drill 0.4 pad 0.65)
  Top 0.305: T12.1 v38.1,76.52
  Bottom 0.305: ARDUINO_NANO1.28 101.6,93.98 82.55,74.93 38.73,74.93 38.1,75.56 v38.1,76.52
N$41
  Top 0.203: SV8.21 34.58,14.89 USBC2.A2
N$42
  Top 0.203: SV8.19 46.99,26.67 35.08,14.76 USBC2.A3
N$43
  Top 0.305: R16.2 R17.2 140.97,75.56 139.06,77.47 130.18,77.47 ARDUINO_NANO1.13
N$44  (via drill 0.4 pad 0.65)
  Top 0.305: R15.2 v137.16,84.45
  Bottom 0.305: ARDUINO_NANO1.12 124.46,81.28 127.64,84.45 v137.16,84.45
N$45
  Top 0.305: R15.1 140.55,87.34 LDR.2
  Bottom 0.305: ARDUINO_NANO1.11 121.92,81.28 128.02,87.38 LDR.2
N$46  (via drill 0.4 pad 0.65)
  Top 0.305: T11.1 18.59,77.64 19.68,78.74 v33.66,78.74
  Bottom 0.305: v33.66,78.74 37.47,78.74 40.64,75.56 81.92,75.56 99.06,92.71 ARDUINO_NANO1.29
N$47
  Top 0.305: SV8.17 45.09,24.13 35.58,14.62 USBC2.A4
N$48  (via drill 0.4 pad 0.65)
  Top 0.305: T13.1 91.12,76.52 90.81,76.83 90.81,80.64 93.34,83.19 v109.22,83.19
  Bottom 0.305: ARDUINO_NANO1.25 v109.22,83.19
N$49  (via drill 0.4 pad 0.65)
  Top 0.305: T14.1 v118.11,76.52
  Bottom 0.305: ARDUINO_NANO1.22 116.84,92.71 118.11,91.44 v118.11,76.52
N$50
  Top 0.203: USBC2.A5 36.08,10.04 47.62,21.59 SV8.15
N$51
  Top 0.203: SV8.13 45.72,19.05 36.58,9.91 USBC2.A6
N$52
  Top 0.203: USBC2.A7 37.08,9.78 43.81,16.51 SV8.11
N$53
  Top 0.203: USBC2.A8 37.58,9.64 41.91,13.97 SV8.9
N$54
  Top 0.305: USBC2.A9 38.08,9.51 40.01,11.43 SV8.7
N$55
  Top 0.203: USBC2.A10 38.58,9.37 40.01,10.79 46.99,10.79 SV8.5
N$56
  Top 0.203: USBC2.A11 39.08,9.23 40.01,10.16 45.09,10.16 SV8.3
N$57
  Top 0.305: T15.3 R22.1
N$58
  Top 0.305: T18.3 R25.1
N$59
  Top 0.203: USBC1.A2 13.24,10.89 5.33,18.8 SV9.21
N$60
  Top 0.203: USBC1.A3 13.74,11.02 7.87,16.89 SV9.19
N$61
  Top 0.305: USBC1.A4 14.24,11.16 10.41,14.99 SV9.17 9.14,22.61 9.14,24.51 12.57,27.94 SV10.1
N$62
  Top 0.203: USBC1.A5 14.74,19.55 SV9.15
N$63
  Top 0.203: SV9.13 15.24,21.09 USBC1.A6
N$64
  Top 0.203: USBC1.A7 15.74,9.52 18.03,11.81 SV9.11
N$65
  Top 0.203: USBC1.A8 16.24,9.39 20.57,13.72 SV9.9
N$66
  Top 0.305: USBC1.A9 16.74,9.25 23.11,15.62 SV9.7
N$67
  Top 0.203: SV9.5 25.65,17.53 17.24,9.12 USBC1.A10
N$68
  Top 0.203: USBC1.A11 17.74,8.98 28.19,19.43 SV9.3
N$69
  Top 0.305: R24.1 65.19,79.59 66.04,78.74 T17.3
N$70
  Top 0.305: T16.3 R23.1
N$71
  Bottom 0.203: SV9.4 26.92,22.61 26.92,18.8 17.65,9.53 17.65,6.35 | 17.65,6.34 17.65,6.35 | 17.65,6.35 17.65,6.15 USBC1.B2
N$72
  Bottom 0.203: SV9.6 24.38,22.61 24.38,19.43 17.27,12.32 17.27,6.35 | 17.27,6.27 17.27,6.35 | 17.27,6.35 17.27,6.09 USBC1.B3
N$73
  Bottom 0.305: USBC1.B4 16.69,14.92 21.84,20.07 21.84,22.61 SV9.8
N$74
  Bottom 0.203: 32.64,24.51 32.38,24.77 | 32.38,24.77 31.37,25.78 21.84,25.78 20.57,24.51 SV9.10 | USBC1.B5 16.29,4.66 16.76,4.19 20.57,4.19 21.59,5.21 21.59,9.53 32.38,20.32 32.38,24.77
N$75
  Bottom 0.203: USBC1.B6 15.89,18.56 16.76,19.43 16.76,22.61 SV9.12
N$76
  Top 0.305: T15.2 129.07,66.5 131.44,64.14 131.44,48.16 SV4.12
N$77
  Bottom 0.203: SV9.22 6.6,22.61 6.6,18.16 13.34,11.43 13.34,6.15 USBC1.B11
N$78
  Bottom 0.203: SV9.20 9.14,22.61 9.14,16.89 13.72,12.32 13.72,6.99 | 13.72,6.99 13.72,6.91 | 13.72,6.99 13.72,6.09 USBC1.B10
N$79
  Bottom 0.305: USBC1.B9 14.29,17.46 11.68,20.07 11.68,22.61 SV9.18
N$80
  Bottom 0.203: SV9.16 11.05,25.78 2.29,25.78 1.27,24.77 1.27,13.34 10.41,4.19 14.22,4.19 14.69,4.66 USBC1.B8
N$81
  Bottom 0.203: USBC1.B7 15.09,18.56 14.22,19.43 14.22,22.61 SV9.14
N$82
  Top 0.305: T16.2 101.14,65.23 103.85,62.52 SV3.12
N$83
  Bottom 0.203: SV8.4 50.16,7.62 45.72,7.62 44.45,8.89 40.01,8.89 38.99,7.87 38.99,6.15 USBC2.B2
N$84
  Bottom 0.203: SV8.6 50.16,10.16 40.01,10.16 38.61,8.76 38.61,6.09 USBC2.B3
N$85
  Bottom 0.305: SV8.8 50.16,12.7 41.91,12.7 38.03,8.82 USBC2.B4
N$86
  Bottom 0.203: USBC2.B5 37.63,4.28 38.73,3.17 46.99,3.17 48.26,1.91 52.07,1.91 53.34,3.17 53.34,12.06 SV8.10
N$87
  Bottom 0.203: SV8.12 50.16,15.24 43.81,15.24 37.23,8.65 USBC2.B6
N$88
  Top 0.305: SV2.12 62.87,52.09 62.87,80.64 63.5,81.28 68.58,81.28 69.05,80.81 T17.2
N$89
  Bottom 0.203: SV8.22 52.7,30.48 52.7,32.38 52.07,33.02 46.99,33.02 31.11,17.14 31.11,5.08 31.75,4.45 33.41,4.45 34.43,5.46 USBC2.B11
N$90
  Top 0.203: SV8.20 53.98,24.13 53.98,3.17 52.07,1.27 48.26,1.27 45.72,3.81 36.83,3.81 35.23,5.41 USBC2.B10
N$91  (via drill 0.4 pad 0.65)
  Top 0.305: v41.27,25.4 38.73,27.94 SV10.3
  Bottom 0.305: USBC2.B9 35.63,8.32 47.62,20.32 52.07,20.32 52.7,20.95 52.7,22.86 SV8.18 50.16,25.4 v41.27,25.4
N$92
  Top 0.203: USBC2.B8 37.5,4.45 45.72,4.45 48.26,1.91 52.07,1.91 53.34,3.17 53.34,19.68 SV8.16
N$93
  Bottom 0.203: SV8.14 50.16,17.78 45.72,17.78 36.43,8.49 USBC2.B7
N$94  (via drill 0.4 pad 0.65)
  Top 0.254: RPI.12 120.52,4.6 v120.52,8.13 | v130.05,8.13 143.72,21.8 R16.1
  Bottom 0.254: v120.52,8.13 v130.05,8.13
N$95
  Top 0.305: T18.2 27.48,65.23 31.35,61.36 SV1.12
N$96
  Top 0.305: R19.2 133.99,78.11 132.08,80.01 ARDUINO_NANO1.15
N$101
  Top 0.305: T15.1 129.07,77.3 127.64,78.74 97.79,78.74 96.52,80.01 ARDUINO_NANO1.1
N$102  (via drill 0.4 pad 0.65)
  Top 0.305: T18.1 28.43,77.47 v33.66,77.47 | v92.71,83.82 107.95,83.82 108.58,83.82 118.75,93.98 120.02,93.98 ARDUINO_NANO1.20
  Bottom 0.305: v33.66,77.47 36.83,74.3 83.19,74.3 v92.71,83.82
N$103  (via drill 0.4 pad 0.65)
  Top 0.305: v69.47,76.58 69.05,77 T17.1
  Bottom 0.305: v69.47,76.58 69.85,76.2 81.28,76.2 97.79,92.71 97.79,96.52 98.42,97.16 106.05,97.16 106.68,96.52 ARDUINO_NANO1.26
N$104  (via drill 0.4 pad 0.65)
  Top 0.305: T16.1 101.92,76.52 v102.87,77.47 | v102.87,92.71 98.42,92.71 96.52,94.61 ARDUINO_NANO1.30
  Bottom 0.305: v102.87,77.47 v102.87,92.71
N$122
  Top 0.305: IC1.11 82.55,83.19 84.45,85.09 108.58,85.09 ARDUINO_NANO1.21
N$123
  Top 0.305: IC1.12 104.14,85.72 ARDUINO_NANO1.23
N$124
  Top 0.305: IC1.13 104.14,88.27 ARDUINO_NANO1.24
N$125  (via drill 0.4 pad 0.65)
  Top 0.305: IC1.10 v83.19,80.64 | v83.19,89.53 102.23,89.53 104.14,91.44 ARDUINO_NANO1.27
  Bottom 0.305: v83.19,80.64 v83.19,89.53
VDD  (via drill 0.55 pad 1.3)
  Top 0.254: SV5.1 73.32,27.3 R18.1
  Top 0.61: 33.66,87.95 v24.77,87.95 C7.1 C6.1 16.19,87.95 15.24,88.9 SV7.3 v9.53,88.9 | 33.66,87.95 50.48,87.95 60.58,98.04 78.49,98.04 IC1.16 82.93,98.17 141.22,98.17 143.72,95.67 R19.1 R17.1 | SV6.3 33.66,87.95 | 17.78,29.21 SV10.2 17.78,31.69 C12.1 C11.1 17.84,34.86 v13.34,39.37
  Bottom 0.61: v24.77,87.95 24.77,83.19 22.23,80.64 15.88,80.64 13.34,78.11 v13.34,39.37 18.8,33.91 57.53,33.91 60.96,30.48 67.94,30.48 69.22,29.21 SV5.1